# EAGLE design PP1 (EAGLE 9.6.2)
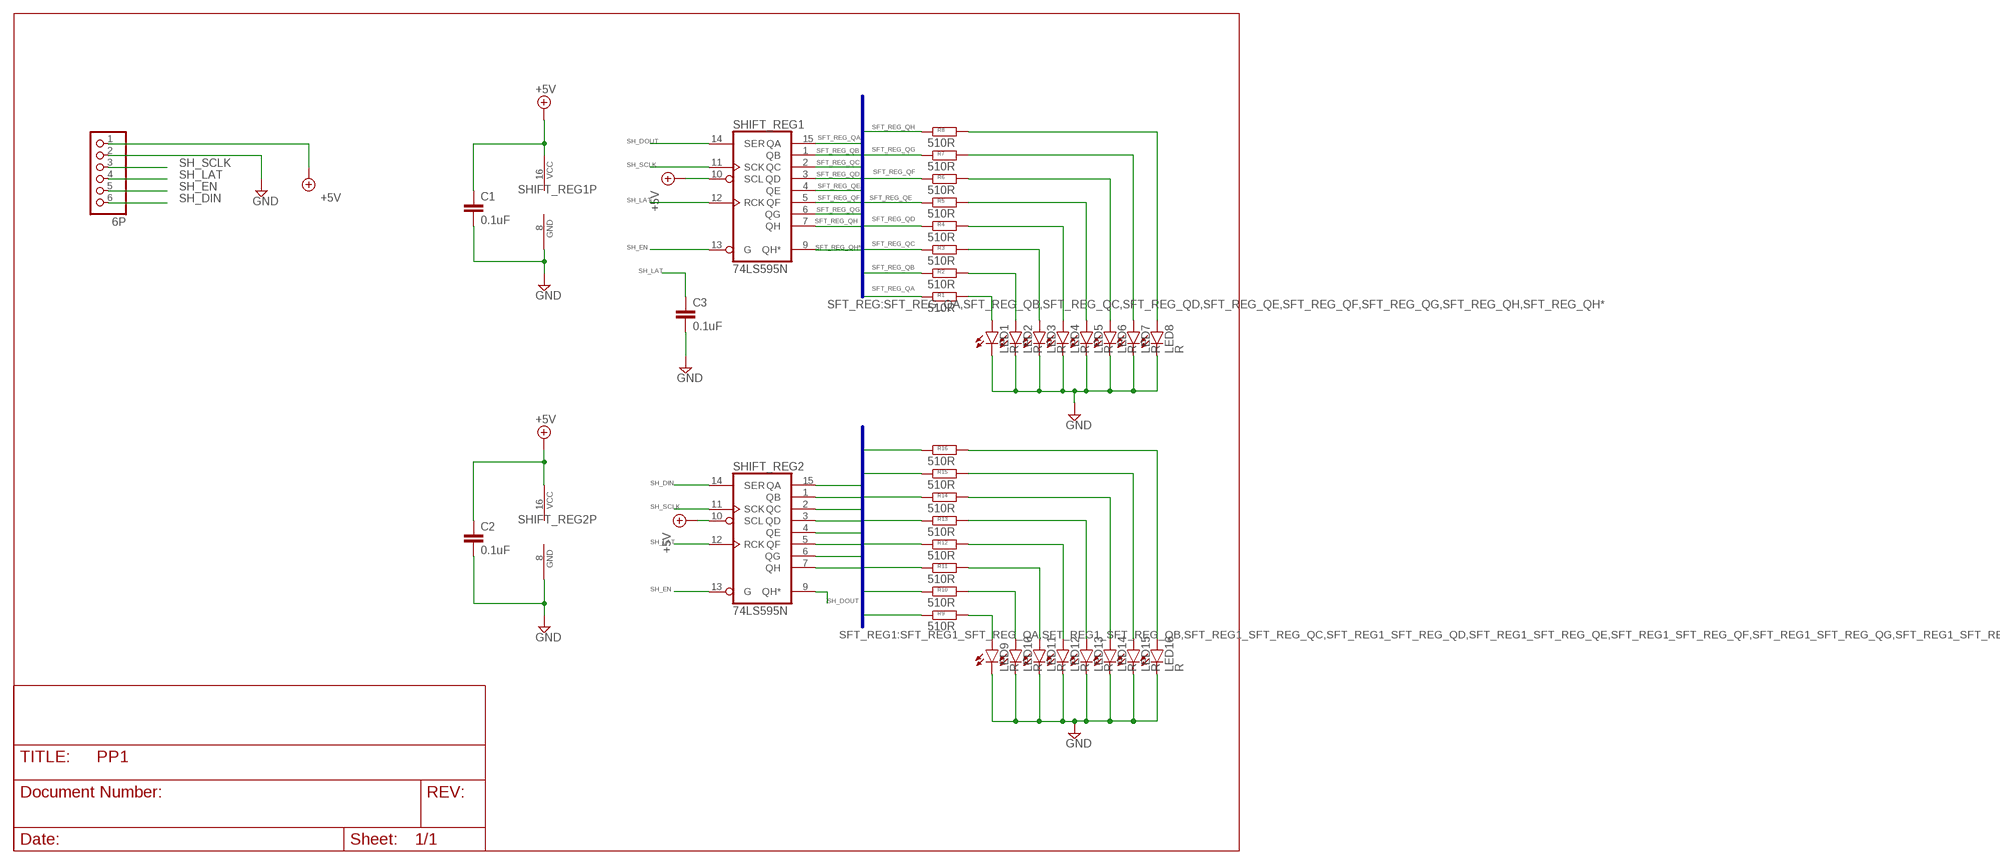
[diagram p0: schematic, sheet 1]

## Parts
C1  0.1uF  C-EU050-030X075  [C050-030X075]
C2  0.1uF  C-EU050-030X075  [C050-030X075]
C3  0.1uF  C-EU050-030X075  [C050-030X075]
INPUT  6P  PINHD-1X6/90  [1X06/90]
LED1  R  LED5MM  [LED5MM]
LED2  R  LED5MM  [LED5MM]
LED3  R  LED5MM  [LED5MM]
LED4  R  LED5MM  [LED5MM]
LED5  R  LED5MM  [LED5MM]
LED6  R  LED5MM  [LED5MM]
LED7  R  LED5MM  [LED5MM]
LED8  R  LED5MM  [LED5MM]
LED9  R  LED5MM  [LED5MM]
LED10  R  LED5MM  [LED5MM]
LED11  R  LED5MM  [LED5MM]
LED12  R  LED5MM  [LED5MM]
LED13  R  LED5MM  [LED5MM]
LED14  R  LED5MM  [LED5MM]
LED15  R  LED5MM  [LED5MM]
LED16  R  LED5MM  [LED5MM]
R1  510R  R-EU_0207/10  [0207/10]
R2  510R  R-EU_0207/10  [0207/10]
R3  510R  R-EU_0207/10  [0207/10]
R4  510R  R-EU_0207/10  [0207/10]
R5  510R  R-EU_0207/10  [0207/10]
R6  510R  R-EU_0207/10  [0207/10]
R7  510R  R-EU_0207/10  [0207/10]
R8  510R  R-EU_0207/10  [0207/10]
R9  510R  R-EU_0207/10  [0207/10]
R10  510R  R-EU_0207/10  [0207/10]
R11  510R  R-EU_0207/10  [0207/10]
R12  510R  R-EU_0207/10  [0207/10]
R13  510R  R-EU_0207/10  [0207/10]
R14  510R  R-EU_0207/10  [0207/10]
R15  510R  R-EU_0207/10  [0207/10]
R16  510R  R-EU_0207/10  [0207/10]
SHIFT_REG1  74LS595N  [DIL16]
SHIFT_REG2  74LS595N  [DIL16]

## Nets
+5V [POWER]: C1.1 C2.1 INPUT.1 SHIFT_REG1.10(SCL) SHIFT_REG1.16(VCC) SHIFT_REG2.10(SCL) SHIFT_REG2.16(VCC)
GND [POWER]: C1.2 C2.2 C3.2 INPUT.2 LED1.K(C) LED2.K(C) LED3.K(C) LED4.K(C) LED5.K(C) LED6.K(C) LED7.K(C) LED8.K(C) LED9.K(C) LED10.K(C) LED11.K(C) LED12.K(C) LED13.K(C) LED14.K(C) LED15.K(C) LED16.K(C) SHIFT_REG1.8(GND) SHIFT_REG2.8(GND)
N$1: LED1.A R1.2
N$2: LED2.A R2.2
N$3: LED3.A R3.2
N$4: LED4.A R4.2
N$5: LED5.A R5.2
N$6: LED6.A R6.2
N$7: LED9.A R9.2
N$8: LED10.A R10.2
N$9: LED7.A R7.2
N$10: LED8.A R8.2
N$11: LED11.A R11.2
N$12: LED12.A R12.2
N$13: LED13.A R13.2
N$14: LED14.A R14.2
N$15: LED15.A R15.2
N$16: LED16.A R16.2
SFT_REG1_SFT_REG_QA: R9.1 SHIFT_REG2.15(QA)
SFT_REG1_SFT_REG_QB: R10.1 SHIFT_REG2.1(QB)
SFT_REG1_SFT_REG_QC: R11.1 SHIFT_REG2.2(QC)
SFT_REG1_SFT_REG_QD: R12.1 SHIFT_REG2.3(QD)
SFT_REG1_SFT_REG_QE: R13.1 SHIFT_REG2.4(QE)
SFT_REG1_SFT_REG_QF: R14.1 SHIFT_REG2.5(QF)
SFT_REG1_SFT_REG_QG: R15.1 SHIFT_REG2.6(QG)
SFT_REG1_SFT_REG_QH: R16.1 SHIFT_REG2.7(QH)
SFT_REG_QA: R1.1 SHIFT_REG1.15(QA)
SFT_REG_QB: R2.1 SHIFT_REG1.1(QB)
SFT_REG_QC: R3.1 SHIFT_REG1.2(QC)
SFT_REG_QD: R4.1 SHIFT_REG1.3(QD)
SFT_REG_QE: R5.1 SHIFT_REG1.4(QE)
SFT_REG_QF: R6.1 SHIFT_REG1.5(QF)
SFT_REG_QG: R7.1 SHIFT_REG1.6(QG)
SFT_REG_QH: R8.1 SHIFT_REG1.7(QH)
SFT_REG_QH*: SHIFT_REG1.9(QH*)
SH_DIN: INPUT.6 SHIFT_REG2.14(SER)
SH_DOUT: SHIFT_REG1.14(SER) SHIFT_REG2.9(QH*)
SH_EN: INPUT.5 SHIFT_REG1.13(G) SHIFT_REG2.13(G)
SH_LAT: C3.1 INPUT.4 SHIFT_REG1.12(RCK) SHIFT_REG2.12(RCK)
SH_SCLK: INPUT.3 SHIFT_REG1.11(SCK) SHIFT_REG2.11(SCK)

## Buses
SFT_REG:SFT_REG_QA,SFT_REG_QB,SFT_REG_QC,SFT_REG_QD,SFT_REG_QE,SFT_REG_QF,SFT_REG_QG,SFT_REG_QH,SFT_REG_QH*
SFT_REG1:SFT_REG1_SFT_REG_QA,SFT_REG1_SFT_REG_QB,SFT_REG1_SFT_REG_QC,SFT_REG1_SFT_REG_QD,SFT_REG1_SFT_REG_QE,SFT_REG1_SFT_REG_QF,SFT_REG1_SFT_REG_QG,SFT_REG1_SFT_REG_QH*,SFT_REG1_SFT_REG_QH

## Library data of the parts
C1-C3 = rcl:C-EU: CAPACITOR, European symbol; SPICEPREFIX: C
INPUT = pinhead:PINHD-1X6: PIN HEADER
LED1-LED16 = led:LED: LED OSRAM: - CHIPLED LG R971, LG N971, LY N971, LG Q971, LY Q971, LO R971, LY R971 LH N974, LH R974 LS Q976, LO Q976, LY Q976 LO Q996 - Hyper CHIPLED LW Q18S LB Q993, LB Q99A, LB R99A - SideLED LS A670, LO A670, LY A670, LG A670, LP A670 LB A673, LV A673, LT A673, LW A673 LH A674 LY A675 LS A676, LA A676, LO A676, LY A676, LW A676 LS A679, LY A679, LG A679 - Hyper Micro SIDELED® LS Y876, LA Y876, LO Y876, LY Y876 LT Y87S - SmartLED LW L88C, LW L88S LB L89C, LB L89S, LG L890 LS L89K, LO L89K, LY L89K LS L896, LA L896, LO L896, LY L896 - TOPLED LS T670, LO T670, LY T670, LG T670, LP T670 LSG T670, LSP T670, LSY T670, LOP T670, LYG T670 LG T671, LOG T671, LSG T671 LB T673, LV T673, LT T673, LW T673 LH T674 LS T676, LA T676, LO T676, LY T676, LB T676, LH T676, LSB T676, LW T676 LB T67C, LV T67C, LT T67C, LS T67K, LO T67K, LY T67K, LW E67C LS E67B, LA E67B, LO E67B, LY E67B, LB E67C, LV E67C, LT E67C LW T67C LS T679, LY T679, LG T679 LS T770, LO T770, LY T770, LG T770, LP T770 LB T773, LV T773, LT T773, LW T773 LH T774 LS E675, LA E675, LY E675, LS T675 LS T776, LA T776, LO T776, LY T776, LB T776 LHGB T686 LT T68C, LB T68C - Hyper Mini TOPLED® LB M676 - Mini TOPLED Santana® LG M470 LS M47K, LO M47K, LY M47K Source: http://www.osram.convergy.de LUXEON: - LUMILED® LXK2-PW12-R00, LXK2-PW12-S00, LXK2-PW14-U00, LXK2-PW14-V00 LXK2-PM12-R00, LXK2-PM12-S00, LXK2-PM14-U00 LXK2-PE12-Q00, LXK2-PE12-R00, LXK2-PE12-S00, LXK2-PE14-T00, LXK2-PE14-U00 LXK2-PB12-K00, LXK2-PB12-L00, LXK2-PB12-M00, LXK2-PB14-N00, LXK2-PB14-P00, LXK2-PB14-Q00 LXK2-PR12-L00, LXK2-PR12-M00, LXK2-PR14-Q00, LXK2-PR14-R00 LXK2-PD12-Q00, LXK2-PD12-R00, LXK2-PD12-S00 LXK2-PH12-R00, LXK2-PH12-S00 LXK2-PL12-P00, LXK2-PL12-Q00, LXK2-PL12-R00 Source: www.luxeon.com KINGBRIGHT: KA-3528ASYC Source: www.kingbright.com
R1-R16 = rcl:R-EU_: RESISTOR, European symbol; SPICEPREFIX: R
SHIFT_REG1 SHIFT_REG2 = 74xx-us:74*595: 8-bit SHIFT REGISTER, output latch

## Net classes
0 default: width 0.254 mm, drill 0.406 mm, clearance 0.305 mm
1 POWER: width 0.406 mm, drill 0.406 mm, clearance 0.305 mm

## Board
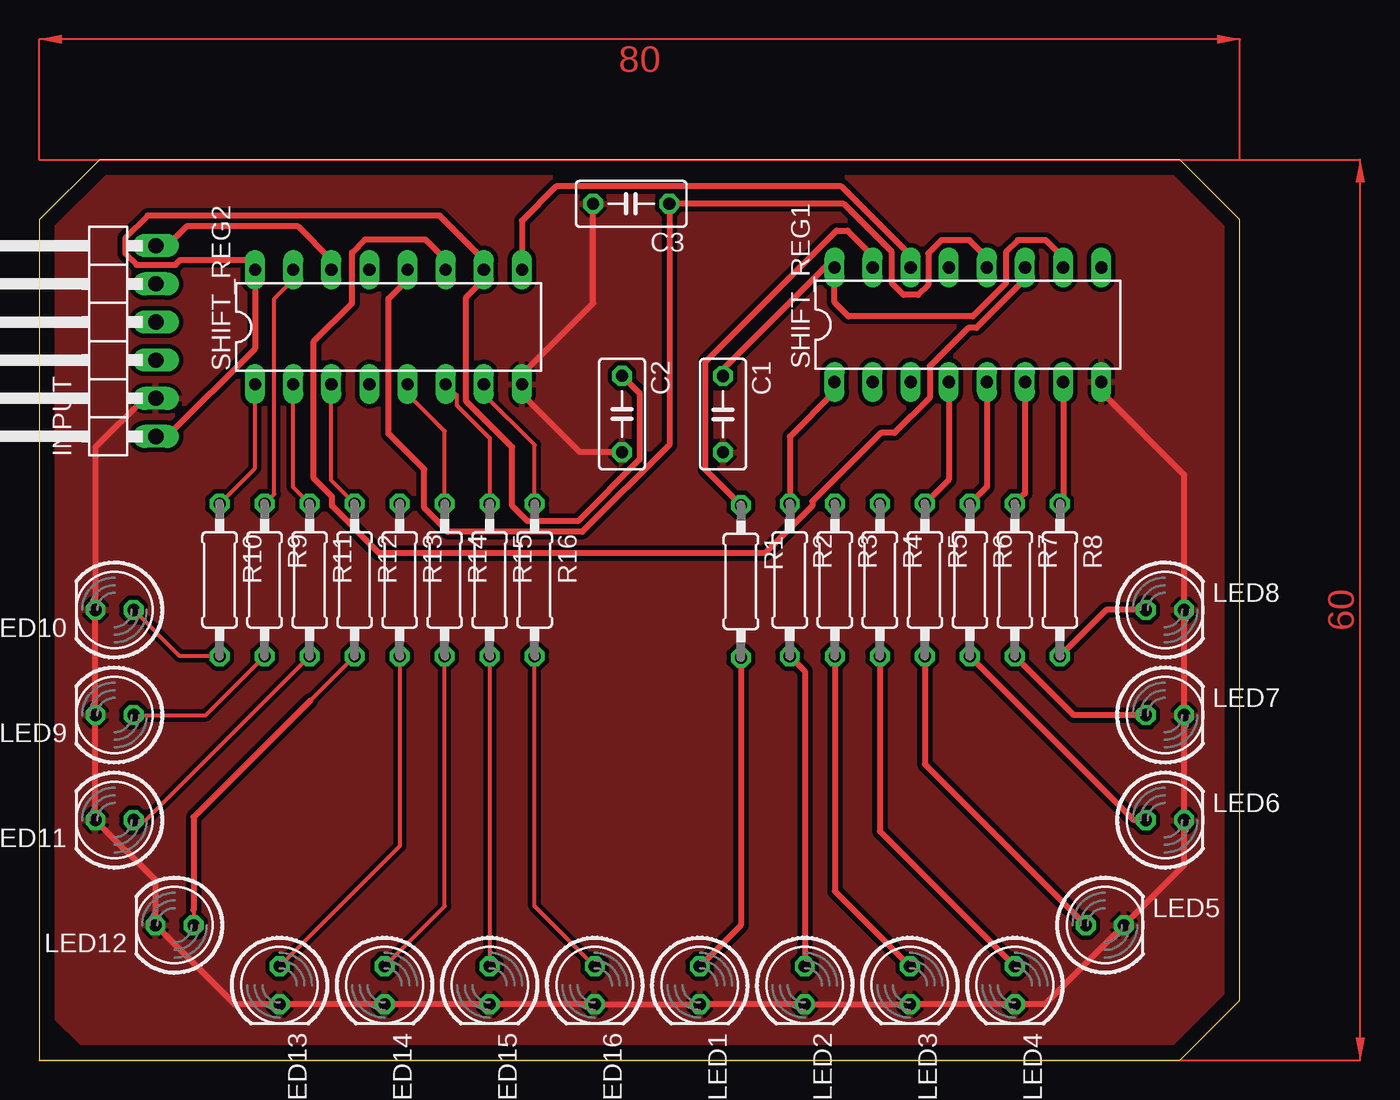
[diagram p1: board, top side]
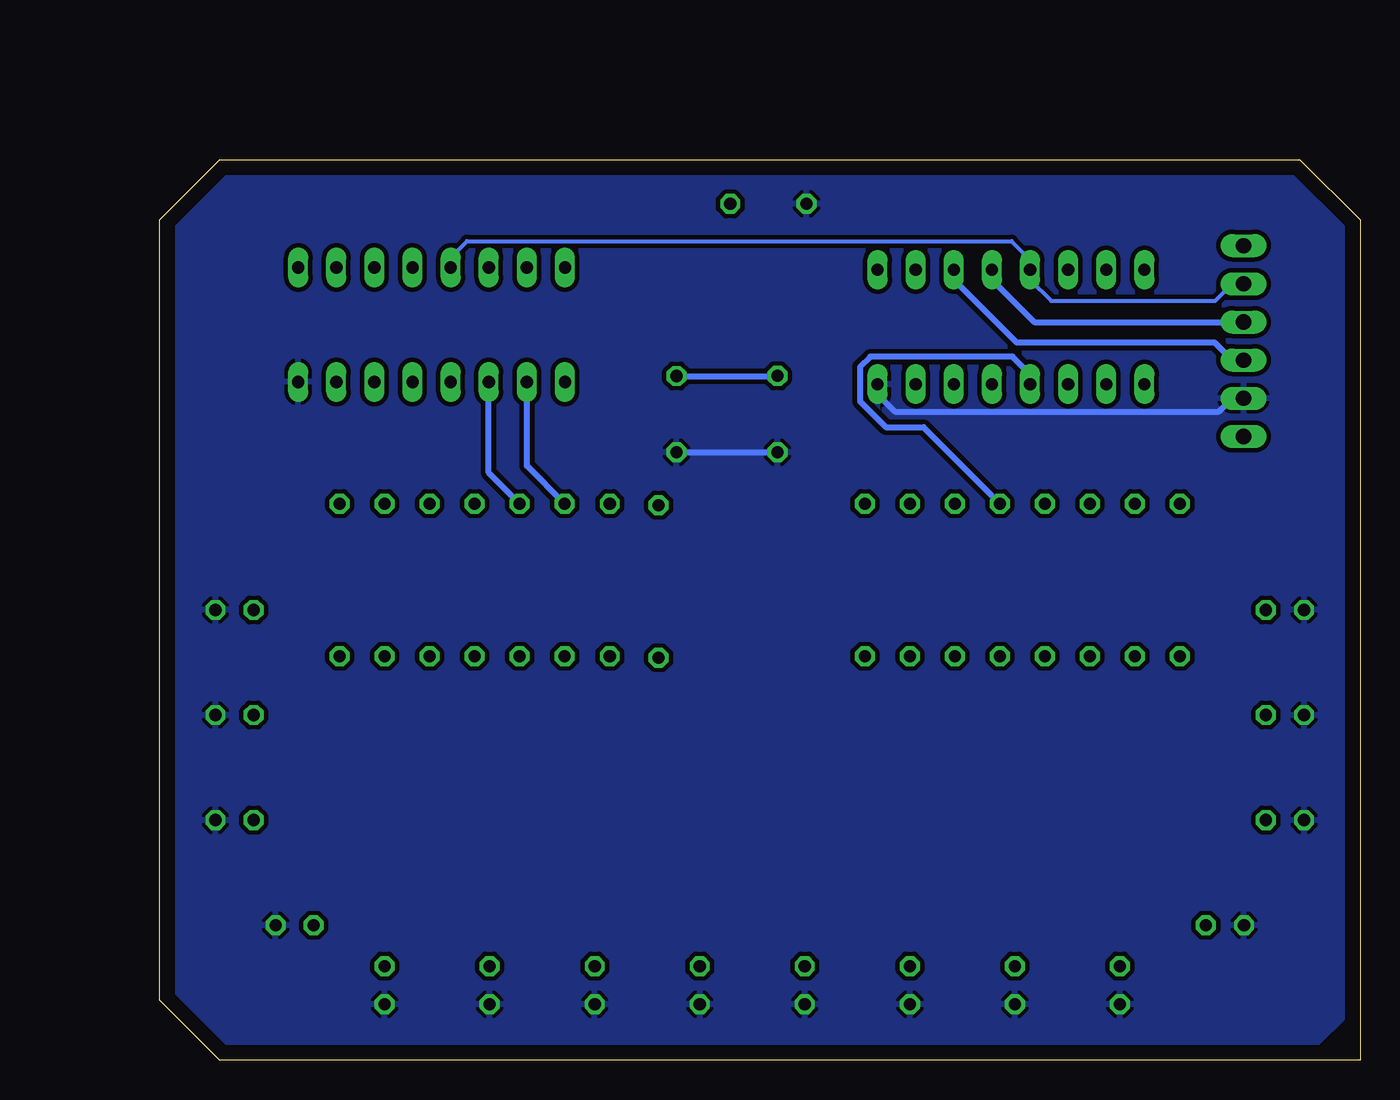
[diagram p2: board, bottom side, seen from below]

Size 80 x 60 mm. Coordinates in mm from the lower left corner, seen from the top.
Outline: 0,56 0,0 76,0 80,4 80,56 76,60 4,60 0,56
Copper layers (1*16): Top 0.035mm / dielectric 1.5mm / Bottom 0.035mm
Design rules "default *": minimum track width 8mil, minimum drill 0.35mm, track to track 8mil, track to pad 8mil, pad to pad 8mil, via to via 8mil, smd to smd 8mil, copper to edge 40mil, drill to drill 6mil, minimum pad ring 10mil, minimum via ring 8mil, stop-mask expansion 4mil, vias tented up to drill 0mil, thermal gap 10mil

### Footprints (pad centres in the part's own frame; a part is rotated, then mirrored left to right if it is on the bottom)
C050-030X075 = drill 0.813 octagon: 1 -2.54,0; 2 2.54,0
1X06/90 = drill 1.016 long: 1 -6.35,-3.81; 2 -3.81,-3.81; 3 -1.27,-3.81; 4 1.27,-3.81; 5 3.81,-3.81; 6 6.35,-3.81
LED5MM = drill 0.813 octagon: A -1.27,0; K 1.27,0
0207/10 = drill 0.813 octagon: 1 -5.08,0; 2 5.08,0
DIL16 = drill 0.813 long: 1 -8.89,-3.81; 2 -6.35,-3.81; 3 -3.81,-3.81; 4 -1.27,-3.81; 5 1.27,-3.81; 6 3.81,-3.81; 7 6.35,-3.81; 8 8.89,-3.81; 9 8.89,3.81; 10 6.35,3.81; 11 3.81,3.81; 12 1.27,3.81; 13 -1.27,3.81; 14 -3.81,3.81; 15 -6.35,3.81; 16 -8.89,3.81

### Placement (x,y rotation side)
C1  45.55,43.04 270 top
C2  38.82,43.05 270 top
C3  39.43,57.05 180 top
INPUT  3.95,47.91 90 top
LED1  44,5 270 top
LED2  51,5 270 top
LED3  58,5 270 top
LED4  65,5 270 top
LED5  71,9 0 top
LED6  75,16 0 top
LED7  75,23 0 top
LED8  75,30 0 top
LED9  5,23 180 top
LED10  5,30 180 top
LED11  5,16 180 top
LED12  9,9 180 top
LED13  16,5 270 top
LED14  23,5 270 top
LED15  30,5 270 top
LED16  37,5 270 top
R1  46.74,31.9 270 top
R2  50,32 270 top
R3  53,32 270 top
R4  56,32 270 top
R5  59,32 270 top
R6  62,32 270 top
R7  65,32 270 top
R8  68,32 270 top
R9  15,32 270 top
R10  12,32 270 top
R11  18,32 270 top
R12  21,32 270 top
R13  24,32 270 top
R14  27,32 270 top
R15  30,32 270 top
R16  33,32 270 top
SHIFT_REG1  61.87,49 0 top
SHIFT_REG2  23.26,48.85 0 top

### Tracks (layer width: path | path; a pad name or v marks a point on that pad's centre or on a via)
+5V
  Top 0.406: INPUT.1 8.52,41.56 14.37,47.41 14.37,52 SHIFT_REG2.16 14.37,53.32 9.38,53.32 9.05,52.99 6.47,52.99 5.73,53.73 5.73,54.79 7.2,56.26 26.67,56.26 29.61,53.32 SHIFT_REG2.10 29.61,52 28.44,50.83 28.44,43.9 29.13,43.21 29.14,43.21 31.5,40.85 31.5,36.93 32.52,35.91 35.87,35.91 39.99,40.03 39.99,44.42 C2.1 | SHIFT_REG1.10 68.22,53.47 67.05,54.64 65.2,54.64 64.41,53.85 64.41,51.77 62.2,49.56 53.91,49.56 52.98,50.49 52.98,52.15 SHIFT_REG1.16 52.98,53.47 45.55,46.04 C1.1
  Bottom 0.406: C1.1 C2.1
GND
  Top 0.406: SHIFT_REG1.8 70.76,44.53 76.27,39.02 LED8.K LED7.K LED6.K 76.27,13 LED5.K 67,3.73 LED4.K LED3.K LED2.K LED1.K LED16.K LED15.K LED14.K LED13.K 13,3.73 LED12.K 7.73,12 LED11.K LED9.K LED10.K 3.73,40.83 7,44.1 INPUT.2 | C3.2 36.89,50.44 32.15,45.7 SHIFT_REG2.8 32.15,44.38 36.02,40.51 C2.2
  Bottom 0.406: C1.2 C2.2 | SHIFT_REG2.8 32.15,44.38 30.98,43.21 9.41,43.21 8.52,44.1 INPUT.2
  pour Top: 0,56 0,4 4,0 76,0 80,4 80,56 76,60 4,60
  pour Bottom: 0,56 4,60 76,60 80,56 80,4 76,0 4,0 0,4
N$1
  Top 0.406: R1.2 46.74,9.01 LED1.A
N$2
  Top 0.406: R2.2 51,25.92 LED2.A
N$3
  Top 0.406: R3.2 53,11.27 LED3.A
N$4
  Top 0.406: R4.2 56,15.27 LED4.A
N$5
  Top 0.406: R5.2 59,19.73 LED5.A
N$6
  Top 0.406: LED6.A 72.92,16 R6.2
N$7
  Top 0.254: LED9.A 11.08,23 R9.2
N$8
  Top 0.254: R10.2 9.35,26.92 LED10.A
N$9
  Top 0.406: LED7.A 68.92,23 R7.2
N$10
  Top 0.406: LED8.A 71.08,30 R8.2
N$11
  Top 0.254: LED11.A 7.08,16 R11.2
N$12
  Top 0.254: 10.27,10 LED12.A | R12.2 18.04,23.96
  Top 0.406: 18.04,23.96 10.27,16.19 10.27,10
N$13
  Top 0.254: R13.2 24,14.27 LED13.A
N$14
  Top 0.254: LED14.A 27,10.27 R14.2
N$15
  Top 0.254: R15.2 LED15.A
N$16
  Top 0.254: LED16.A 33,10.27 R16.2
SFT_REG1_SFT_REG_QA
  Top 0.254: R9.1 15.64,37.72 15.64,50.73 16.91,52 SHIFT_REG2.15
SFT_REG1_SFT_REG_QB
  Top 0.254: R10.1 14.37,39.45 14.37,44.38 SHIFT_REG2.1
SFT_REG1_SFT_REG_QC
  Top 0.254: R11.1 16.91,38.17 16.91,44.38 SHIFT_REG2.2
SFT_REG1_SFT_REG_QD
  Top 0.254: R12.1 19.45,38.63 19.45,44.38 SHIFT_REG2.3
SFT_REG1_SFT_REG_QE
  Bottom 0.406: SHIFT_REG2.4 21.99,45.7 23.16,46.87 32.63,46.87 33.32,46.18 33.32,43.9 31.59,42.17 29.09,42.17 R13.1
SFT_REG1_SFT_REG_QF
  Top 0.254: R14.1 27,41.91 24.53,44.38 SHIFT_REG2.5
SFT_REG1_SFT_REG_QG
  Top 0.254: SHIFT_REG2.6 27.81,44.3 27.81,43.63 30,41.44 R15.1
SFT_REG1_SFT_REG_QH
  Top 0.254: R16.1 33,40.99 29.61,44.38 SHIFT_REG2.7
SFT_REG_QA
  Top 0.406: 55.52,53.59 55.52,53.47 SHIFT_REG1.15 55.52,53.59 | R1.1 44.38,39.34 44.38,46.52 53.12,55.26 53.85,55.26 55.52,53.59
SFT_REG_QB
  Top 0.406: SHIFT_REG1.1 52.98,44.53 50,41.55 R2.1
SFT_REG_QC
  Bottom 0.406: R3.1 55.52,39.6 55.52,44.53 SHIFT_REG1.2
SFT_REG_QD
  Bottom 0.406: R4.1 58.06,39.14 58.06,44.53 SHIFT_REG1.3
SFT_REG_QE
  Top 0.406: SHIFT_REG1.4 60.6,44.53 60.6,38.68 R5.1
SFT_REG_QF
  Top 0.406: SHIFT_REG1.5 63.14,44.53 63.14,38.22 R6.1
SFT_REG_QG
  Top 0.406: SHIFT_REG1.6 65.68,44.53 65.68,37.76 R7.1
SFT_REG_QH
  Top 0.406: SHIFT_REG1.7 68.22,44.53 68.22,37.3 R8.1
SH_DIN
  Top 0.406: SHIFT_REG2.14 19.45,53.32 17.22,55.55 9.81,55.55 8.52,54.26 INPUT.6
SH_DOUT
  Top 0.406: SHIFT_REG1.14 58.06,53.47 58.06,53.59 53.43,58.22 34.43,58.22 32.15,55.94 32.15,53.32 SHIFT_REG2.9
SH_EN
  Bottom 0.254: INPUT.5 8.52,51.72 9.65,50.59 20.58,50.59 21.99,52 SHIFT_REG2.13 21.99,53.32 23.23,54.56 59.51,54.56 60.6,53.47 SHIFT_REG1.13
SH_LAT
  Top 0.406: SHIFT_REG1.12 63.14,53.47 61.97,54.64 60.12,54.64 59.23,53.75 59.23,51.67 58.54,50.98 57.58,50.98 56.79,51.77 56.79,53.85 53.59,57.05 C3.1 41.97,41 36.17,35.2 27.23,35.2 25.64,36.79 25.64,39.36 23.26,41.73 23.26,50.73 24.53,52 SHIFT_REG2.12
  Bottom 0.406: SHIFT_REG2.12 24.53,52 21.71,49.18 8.52,49.18 INPUT.4
SH_SCLK
  Top 0.406: SHIFT_REG1.11 65.68,52.15 65.68,52.03 62.45,48.8 61.89,48.8 59.33,46.23 59.33,44.15 56.98,41.8 56.07,41.8 51.5,37.23 51.5,36.93 48.35,33.78 22.65,33.78 19.5,36.93 19.5,37.55 18.28,38.77 18.28,47.88 20.82,50.42 20.82,53.8 21.7,54.68 25.71,54.68 27.07,53.32 SHIFT_REG2.11
  Bottom 0.406: INPUT.3 8.52,46.64 9.68,47.8 22.87,47.8 27.07,52 SHIFT_REG2.11
(copper drawn outside any net)
  shapes: Top area x2